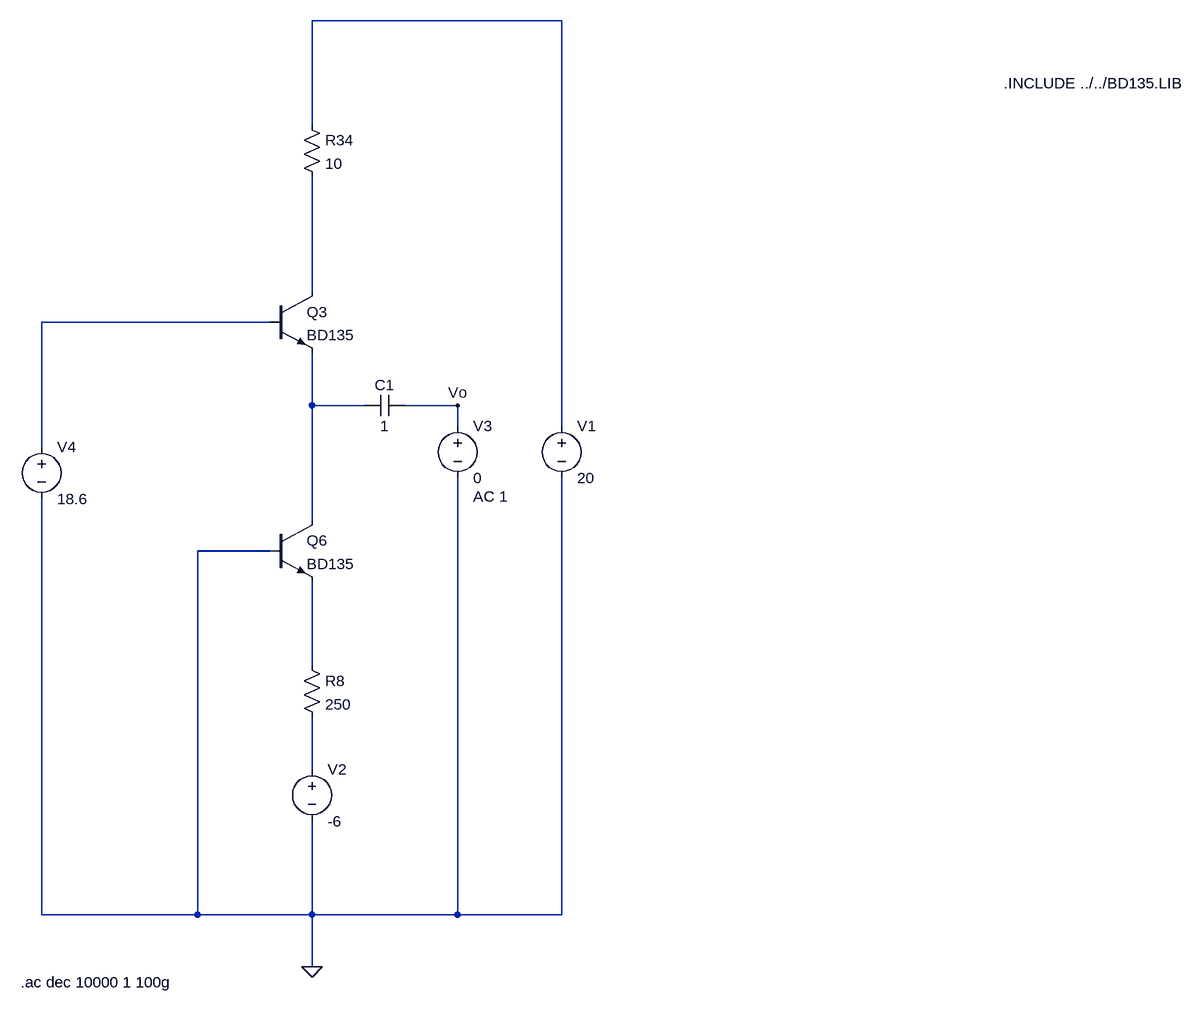
[diagram p0: schematic ro.asc]
ro.asc, the LTspice schematic file:
Version 4
SHEET 1 1572 1176
WIRE 592 -320 208 -320
WIRE 208 -160 208 -320
WIRE 208 96 208 -80
WIRE 144 144 -208 144
WIRE 208 272 208 192
WIRE 288 272 208 272
WIRE 432 272 352 272
WIRE 432 304 432 272
WIRE 592 304 592 -320
WIRE -208 336 -208 144
WIRE 208 448 208 272
WIRE 144 496 32 496
WIRE 208 672 208 544
WIRE 208 832 208 752
WIRE -208 1056 -208 416
WIRE 32 1056 32 496
WIRE 32 1056 -208 1056
WIRE 208 1056 208 912
WIRE 208 1056 32 1056
WIRE 432 1056 432 384
WIRE 432 1056 208 1056
WIRE 592 1056 592 384
WIRE 592 1056 432 1056
WIRE 208 1136 208 1056
FLAG 208 1136 0
FLAG 432 272 Vo
SYMBOL npn 144 96 R0
SYMATTR InstName Q3
SYMATTR Value BD135
SYMBOL npn 144 448 R0
SYMATTR InstName Q6
SYMATTR Value BD135
SYMBOL res 192 656 R0
SYMATTR InstName R8
SYMATTR Value 250
SYMBOL res 192 -176 R0
SYMATTR InstName R34
SYMATTR Value 10
SYMBOL voltage 592 288 R0
WINDOW 123 0 0 Left 0
WINDOW 39 0 0 Left 0
SYMATTR InstName V1
SYMATTR Value 20
SYMBOL voltage 208 816 R0
WINDOW 123 0 0 Left 0
WINDOW 39 0 0 Left 0
SYMATTR InstName V2
SYMATTR Value -6
SYMBOL voltage 432 288 R0
WINDOW 123 24 124 Left 2
WINDOW 39 0 0 Left 0
SYMATTR Value2 AC 1
SYMATTR InstName V3
SYMATTR Value 0
SYMBOL cap 352 256 R90
WINDOW 0 0 32 VBottom 2
WINDOW 3 32 32 VTop 2
SYMATTR InstName C1
SYMATTR Value 1
SYMBOL voltage -208 320 R0
WINDOW 123 0 0 Left 0
WINDOW 39 0 0 Left 0
SYMATTR InstName V4
SYMATTR Value 18.6
TEXT 1272 -224 Left 2 !.INCLUDE ../../BD135.LIB
TEXT -240 1160 Left 2 !.ac dec 10000 1 100g

The netlist it stands for:
* ro.asc
Q3 N002 N003 N004 0 BD135
Q6 N004 0 N005 0 BD135
R8 N005 N006 250
R34 N001 N002 10
V1 N001 0 20
V2 N006 0 -6
V3 Vo 0 0 AC 1
C1 Vo N004 1
V4 N003 0 18.6
.model NPN NPN
.model PNP PNP
.lib standard.bjt
.INCLUDE ../../BD135.LIB
.ac dec 10000 1 100g
.backanno
.end